# Altium schematic sheet mbed-enablement-platform_F_3.SchDoc: Mbed EP - Peripherals
size A4; Date: 10/26/2017 12:01:22 PM; Revision: Firefly; SheetNumber: 3; SheetTotal: 4
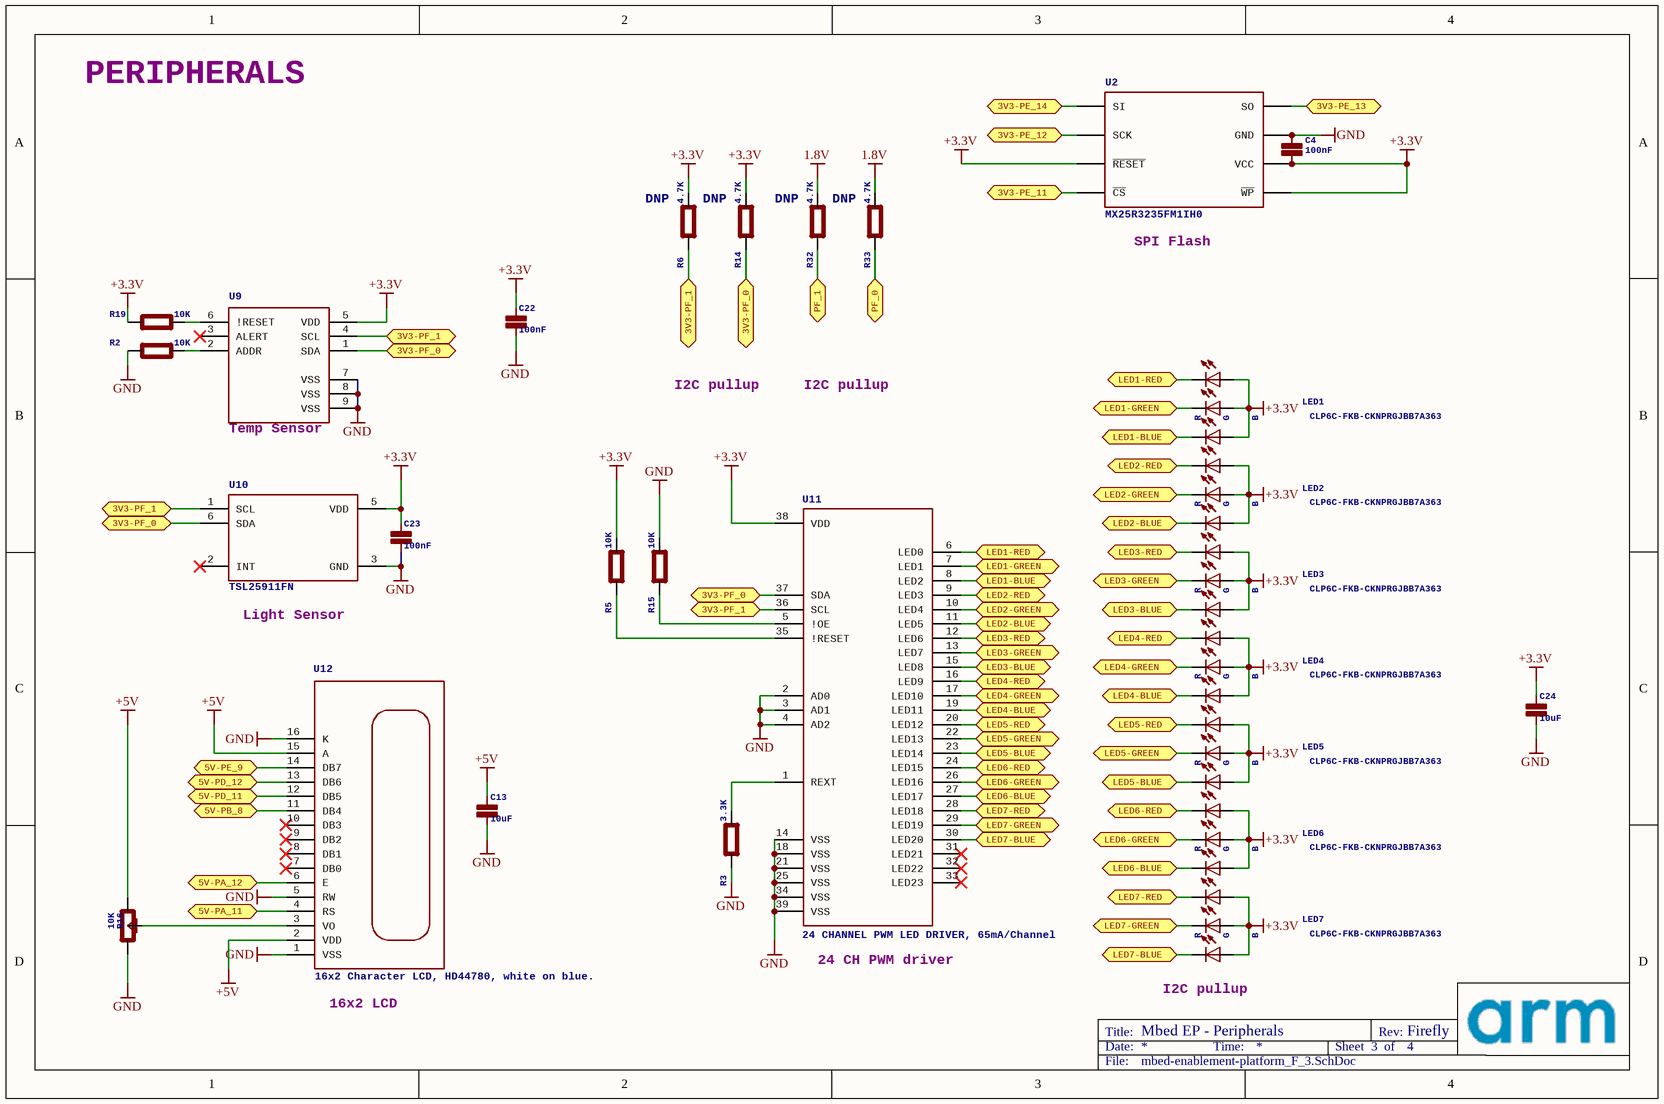
[diagram p0: mbed-enablement-platform_F_3.SchDoc]

## Parts
C4  100nF  [0603]
C13  10uF  [0603]
C22  100nF  [0402]
C23  100nF  [0402]
C24  10uF  [0603]
LED1  CLP6C-FKB-CKNPRGJBB7A363  [6-PLCC]
LED2  CLP6C-FKB-CKNPRGJBB7A363  [6-PLCC]
LED3  CLP6C-FKB-CKNPRGJBB7A363  [6-PLCC]
LED4  CLP6C-FKB-CKNPRGJBB7A363  [6-PLCC]
LED5  CLP6C-FKB-CKNPRGJBB7A363  [6-PLCC]
LED6  CLP6C-FKB-CKNPRGJBB7A363  [6-PLCC]
LED7  CLP6C-FKB-CKNPRGJBB7A363  [6-PLCC]
R2  10K  [0402]
R3  3.3K  [0402]
R5  10K  [0402]
R6  4.7K  [0402]
R14  4.7K  [0402]
R15  10K  [0402]
R16  10K  [TC33X-2-103E]
R19  10K  [0402]
R32  4.7K  [0402]
R33  4.7K  [0402]
U2  MX25R3235FM1IH0  [SO8]
U9  Temperature and Humidity Sensor I2C 2% 8DFN  [8-DFN]  (value not drawn)
U10  TSL25911FN  [6-WFDFN]
U11  24 CHANNEL PWM LED DRIVER, 65mA/Channel  [HTSSOP38]
U12  16x2 Character LCD, HD44780, white on blue.  [LCD1602]

## Ports
3V3-PE_11, 3V3-PE_12, 3V3-PE_13, 3V3-PE_14, 3V3-PF_0, 3V3-PF_1, 5V-PA_11, 5V-PA_12, 5V-PB_8, 5V-PD_11, 5V-PD_12, 5V-PE_9, LED1-BLUE, LED1-GREEN, LED1-RED, LED2-BLUE, LED2-GREEN, LED2-RED, LED3-BLUE, LED3-GREEN, LED3-RED, LED4-BLUE, LED4-GREEN, LED4-RED, LED5-BLUE, LED5-GREEN, LED5-RED, LED6-BLUE, LED6-GREEN, LED6-RED, LED7-BLUE, LED7-GREEN, LED7-RED, PF_0, PF_1

## Nets
1.8V: R32.2(P$2) R33.2(P$2)
+3.3V: C4.2(P$2) C22.1(P$1) C23.1(P$1) C24.1(P$1) LED1.1 LED1.2 LED1.3 LED2.1 LED2.2 LED2.3 LED3.1 LED3.2 LED3.3 LED4.1 LED4.2 LED4.3 LED5.1 LED5.2 LED5.3 LED6.1 LED6.2 LED6.3 LED7.1 LED7.2 LED7.3 R5.2(P$2) R6.2(P$2) R14.2(P$2) R19.1(P$1) U2.3(~{WP}) U2.7(~{RESET}) U2.8(VCC) U9.5(VDD) U10.5(VDD) U11.38(VDD)
+5V: C13.1(P$1) R16.1(P$1) U12.2(VDD) U12.15(A)
GND: C4.1(P$1) C13.2(P$2) C22.2(P$2) C23.2(P$2) C24.2(P$2) R2.1(P$1) R3.1(P$1) R15.2(P$2) R16.3(P$3) U2.4(GND) U9.7(VSS) U9.8(VSS) U9.9(VSS) U10.3(GND) U11.2(AD0) U11.3(AD1) U11.4(AD2) U11.14(VSS) U11.18(VSS) U11.21(VSS) U11.25(VSS) U11.34(VSS) U11.39(VSS) U12.1(VSS) U12.5(RW) U12.16(K)
3V3-PE_11: U2.1(~{CS}) ; port 3V3-PE_11
3V3-PE_12: U2.6(SCK) ; port 3V3-PE_12
3V3-PE_13: U2.2(SO) ; port 3V3-PE_13
3V3-PE_14: U2.5(SI) ; port 3V3-PE_14
3V3-PF_0: R14.1(P$1) U9.1(SDA) U10.6(SDA) U11.37(SDA) ; port 3V3-PF_0
3V3-PF_1: R6.1(P$1) U9.4(SCL) U10.1(SCL) U11.36(SCL) ; port 3V3-PF_1
5V-PA_11: U12.4(RS) ; port 5V-PA_11
5V-PA_12: U12.6(E) ; port 5V-PA_12
5V-PB_8: U12.11(DB4) ; port 5V-PB_8
5V-PD_11: U12.12(DB5) ; port 5V-PD_11
5V-PD_12: U12.13(DB6) ; port 5V-PD_12
5V-PE_9: U12.14(DB7) ; port 5V-PE_9
LED1-BLUE: LED1.4 U11.8(LED2) ; port LED1-BLUE
LED1-GREEN: LED1.5 U11.7(LED1) ; port LED1-GREEN
LED1-RED: LED1.6 U11.6(LED0) ; port LED1-RED
LED2-BLUE: LED2.4 U11.11(LED5) ; port LED2-BLUE
LED2-GREEN: LED2.5 U11.10(LED4) ; port LED2-GREEN
LED2-RED: LED2.6 U11.9(LED3) ; port LED2-RED
LED3-BLUE: LED3.4 U11.15(LED8) ; port LED3-BLUE
LED3-GREEN: LED3.5 U11.13(LED7) ; port LED3-GREEN
LED3-RED: LED3.6 U11.12(LED6) ; port LED3-RED
LED4-BLUE: LED4.4 U11.19(LED11) ; port LED4-BLUE
LED4-GREEN: LED4.5 U11.17(LED10) ; port LED4-GREEN
LED4-RED: LED4.6 U11.16(LED9) ; port LED4-RED
LED5-BLUE: LED5.4 U11.23(LED14) ; port LED5-BLUE
LED5-GREEN: LED5.5 U11.22(LED13) ; port LED5-GREEN
LED5-RED: LED5.6 U11.20(LED12) ; port LED5-RED
LED6-BLUE: LED6.4 U11.27(LED17) ; port LED6-BLUE
LED6-GREEN: LED6.5 U11.26(LED16) ; port LED6-GREEN
LED6-RED: LED6.6 U11.24(LED15) ; port LED6-RED
LED7-BLUE: LED7.4 U11.30(LED20) ; port LED7-BLUE
LED7-GREEN: LED7.5 U11.29(LED19) ; port LED7-GREEN
LED7-RED: LED7.6 U11.28(LED18) ; port LED7-RED
PF_0: R33.1(P$1) ; port PF_0
PF_1: R32.1(P$1) ; port PF_1
NetR2_2: R2.2(P$2) U9.2(ADDR)
NetR3_2: R3.2(P$2) U11.1(REXT)
NetR5_1: R5.1(P$1) U11.35(!RESET)
NetR15_1: R15.1(P$1) U11.5(!OE)
NetR16_2: R16.2(P$2) U12.3(VO)
NetR19_2: R19.2(P$2) U9.6(!RESET)

Not connected (* = marked no-connect by the designer): U9 3(ALERT)*; U10 2(INT)*; U11 31(LED21)* 32(LED22)* 33(LED23)*; U12 7(DB0)* 8(DB1)* 9(DB2)* 10(DB3)*

## Notes on the sheet
- PERIPHERALS
- (near R6) DNP
- DNP
- (near U2) SPI Flash
- I2C pullup
- (near U9) Temp Sensor
- (near U10) Light Sensor
- (near U11) 24 CH PWM driver
- (near U12) 16x2 LCD
- (near LED7) I2C pullup
- Title:
- Date:
- Time:
- Sheet
- Rev:
- of
- File:

## Library data of the parts
C4 C13 C24 = CAPACITOR0603: Capacitor
C22 C23 = CAPACITOR0402: Capacitor
LED1-LED7 = CLP6C-FKB-CKNPRGJBB7A363: LED RGB SMD Diffused; MF: Cree Inc.; MFN: CLP6C-FKB-CKNPRGJBB7A363; OC-DIGIKEY: CLP6C-FKB-CKNPRGJBB7A363CT-ND; OC-MOUSER: 941-P6CFKBCKNPRGJ7A3; OC-NEWARK: 11X6459; B: B; R: R; G: G
R2 R3 R5 R6 R14 R15 R19 R32 R33 = RESISTOR0402: Resistor
R16 = POTENTIOMETER: TRIMMER 10K OHM 0.1W SMD; MF: Bourns Inc.; MFN: TC33X-2-103E; OC-DIGIKEY: TC33X-103ECT-ND; OC-MOUSER: 652-TC33X-2-103E; OC-NEWARK: 97M3836
U2 = MX25R3235FM1IH0: Serial Flash 32 Mb 80 Mhz; MF: Macronix; MFN: MX25R3235FM1IH0; OC-DIGIKEY: 1092-1175-ND; OC-MOUSER: *; OC-NEWARK: *
U9 = SHT31-DIS-B: MF: Sensirion; MFN: SHT31-DIS-B; OC-DIGIKEY: 1649-1011-1-ND; OC-MOUSER: 403-SHT31-DIS-B; OC-NEWARK: 2474218
U10 = TSL25911FN: Sensor Light Digital, High Dynamic Range, 6-WFDFN; MF: ams; MFN: TSL25911FN; OC-DIGIKEY: TSL25911FNCT-ND; OC-MOUSER: 985-TSL25911FN; OC-NEWARK: 09X0688
U11 = PCA9956BTWY: MF: NXP USA Inc.; MFN: PCA9956BTWY; OC-DIGIKEY: 568-12502-1-ND; OC-MOUSER: 771-PCA9956BTWY; OC-NEWARK: 2759860
U12 = 1528-1502-ND: MF: Adafruit Industries LLC; MFN: 181; OC-DIGIKEY: 1528-1502-ND; OC-NEWARK: 53W5770